# Altium schematic sheet GSB-S02-V00-CAN3.SchDoc
size A4
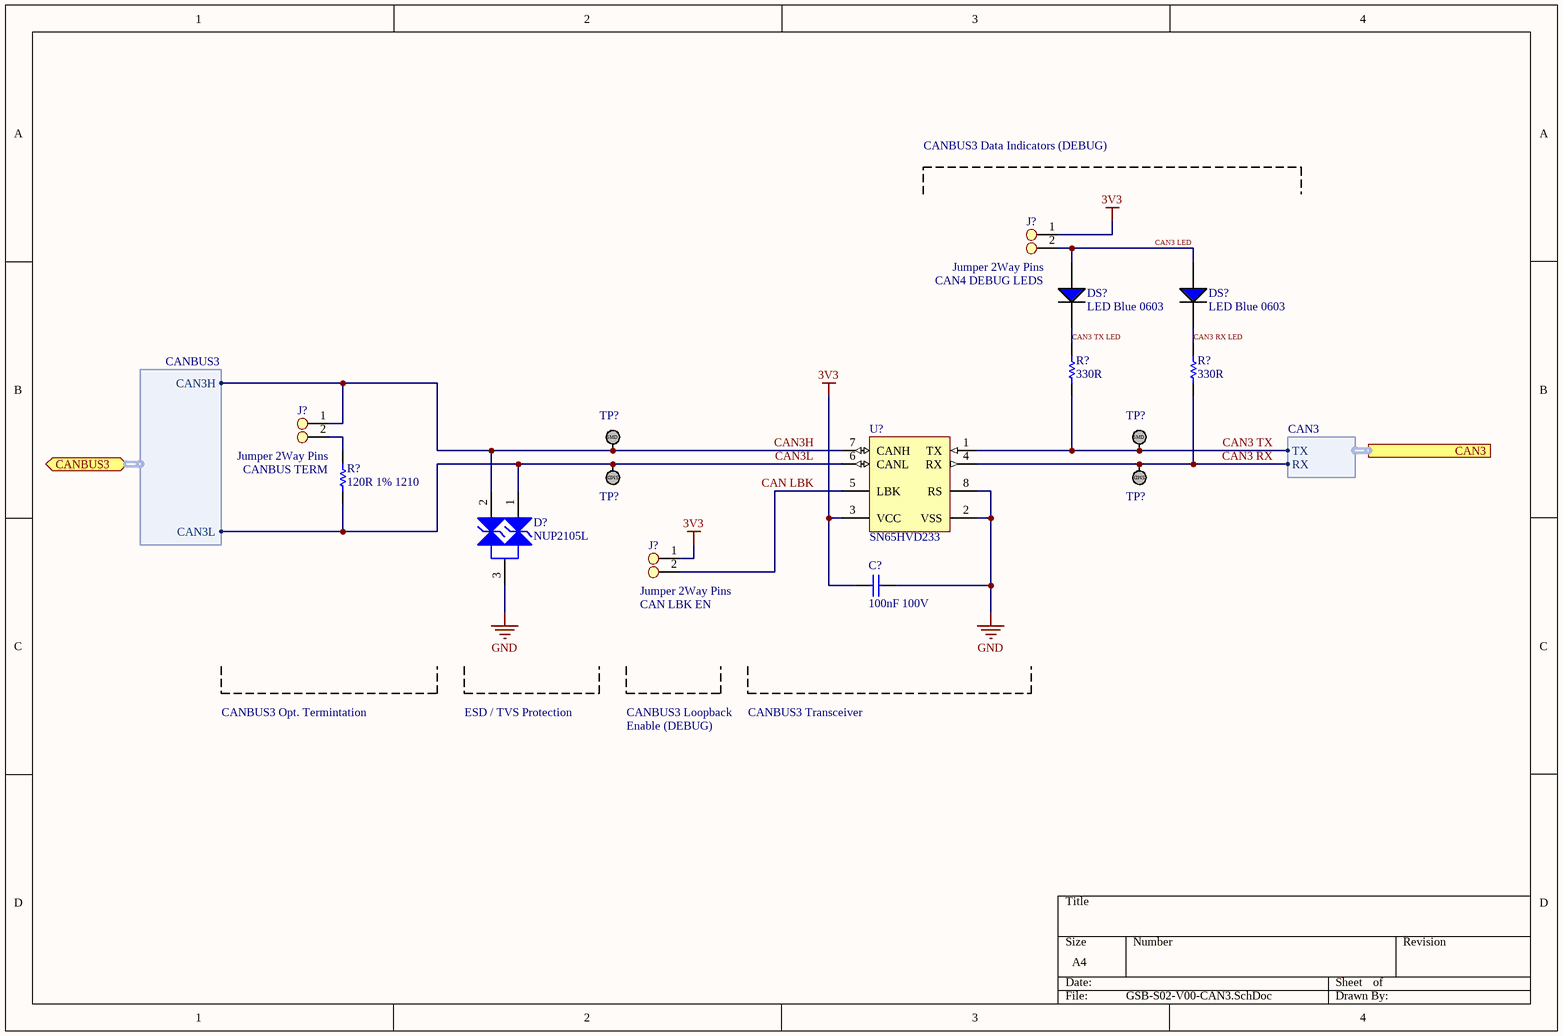
[diagram p0: GSB-S02-V00-CAN3.SchDoc]

## Parts
(Parts that share a designator on the sheet are numbered #1, #2 ... from top to bottom, then left to right.)
C?  100nF 100V  [Cap_Ceramic_0603]
D?  NUP2105L  [NUP2105L]
DS?#1  LED Blue 0603  [LED BLUE 0603]
DS?#2  LED Blue 0603  [LED BLUE 0603]
J?#1  Jumper 2Way Pins  [Jumper_2Way_Pin]
J?#2  Jumper 2Way Pins  [Jumper_2Way_Pin]
J?#3  Jumper 2Way Pins  [Jumper_2Way_Pin]
R?#1  330R  [Res_ThinFilm_0603]
R?#2  330R  [Res_ThinFilm_0603]
R?#3  120R 1% 1210  [Res_ThinFilm_1210]
TP?#1  TestPoint_SMD  [TestPointSMD]  (value not drawn)
TP?#2  TestPoint_SMD  [TestPointSMD]  (value not drawn)
TP?#3  TestPoint_SMD  [TestPointSMD]  (value not drawn)
TP?#4  TestPoint_SMD  [TestPointSMD]  (value not drawn)
U?  SN65HVD233  [SN65HVD233DR]

## Ports
CAN3 (harness CAN3), CANBUS3 (bidir, harness CANBUS3)

## Harnesses
CANBUS3: CAN3H, CAN3L
CAN3: RX, TX

## Nets
3V3: C?.2 J?#1.1 J?#3.1 U?.3(VCC)
GND: C?.1 D?.3 U?.2(VSS) U?.8(RS)
CAN3 LED: DS?#1.1(A) DS?#2.1(A) J?#1.2
CAN3 RX: R?#2.1 TP?#4.1 U?.4(RX) ; port CAN3.RX
CAN3 RX LED: DS?#2.2(C) R?#2.2
CAN3 TX: R?#1.1 TP?#2.1 U?.1(TX) ; port CAN3.TX
CAN3 TX LED: DS?#1.2(C) R?#1.2
CAN3H: D?.2 J?#2.1 TP?#1.1 U?.7(CANH) ; port CANBUS3.CAN3H
CAN3L: D?.1 R?#3.1 TP?#3.1 U?.6(CANL) ; port CANBUS3.CAN3L
CAN LBK: J?#3.2 U?.5(LBK)
NetJ?#2_2: J?#2.2 R?#3.2

## Notes on the sheet
- CANBUS3 Data Indicators (DEBUG)
- CAN4 DEBUG LEDS
- (near R?#3) CANBUS TERM
- (near J?#3) CAN LBK EN
- CANBUS3 Opt. Termintation
- ESD / TVS Protection
- CANBUS3 Loopback
- CANBUS3 Transceiver
- Enable (DEBUG)
- (in symbol TestPoint_SMD) SMD

## Library data of the parts
C? = 100nF 100V 5% X7R 0603: Capacitor, Ceramic, SMD, 100nF, 100V, 5%, X7R, 0603
J?#1-J?#3 = Jumper 2Way Side Pins
R?#1 R?#2 = 330R 5% 0603: Resistor, SMD, 330R, 0.1W, 5%, 0603
R?#3 = 120R 1% 1210: Resistor, SMD, 120R, 0.25W, 1%, 1210
D? = NUP2105L: ComponentLink1Description: Datasheet; ComponentLink1URL: https://www.onsemi.cn/PowerSolutions/document/NUP2105L-D.PDF; Parameter 1: *; ComponentLink2Description: LCSC; ComponentLink2URL: https://lcsc.com/product-detail/TVS_ON-Semiconductor-NUP2105LT1G_C14486.html; ComponentLink3Description: Digikey; ComponentLink3URL: https://www.digikey.com.au/product-detail/en/on-semiconductor/SZNUP2105LT1G/SZNUP2105LT1GOSCT-ND/3487669
U? = SN65HVD233: ComponentLink1Description: LCSC; ComponentLink1URL: https://lcsc.com/product-detail/CAN-ICs_Texas-Instruments_SN65HVD233DRG4_Texas-Instruments-Texas-Instruments-SN65HVD233DRG4_C61643.html; ComponentLink2Description: Digikey; ComponentLink2URL: https://www.digikey.com.au/product-detail/en/texas-instruments/SN65HVD233DR/296-35967-1-ND/4134960; ComponentLink3Description: Datasheet; ComponentLink3URL: https://www.ti.com/lit/ds/symlink/sn65hvd233.pdf?ts=1588560888178; ComponentLink4Description: Ti Product Page; ComponentLink4URL: https://www.ti.com/product/SN65HVD233